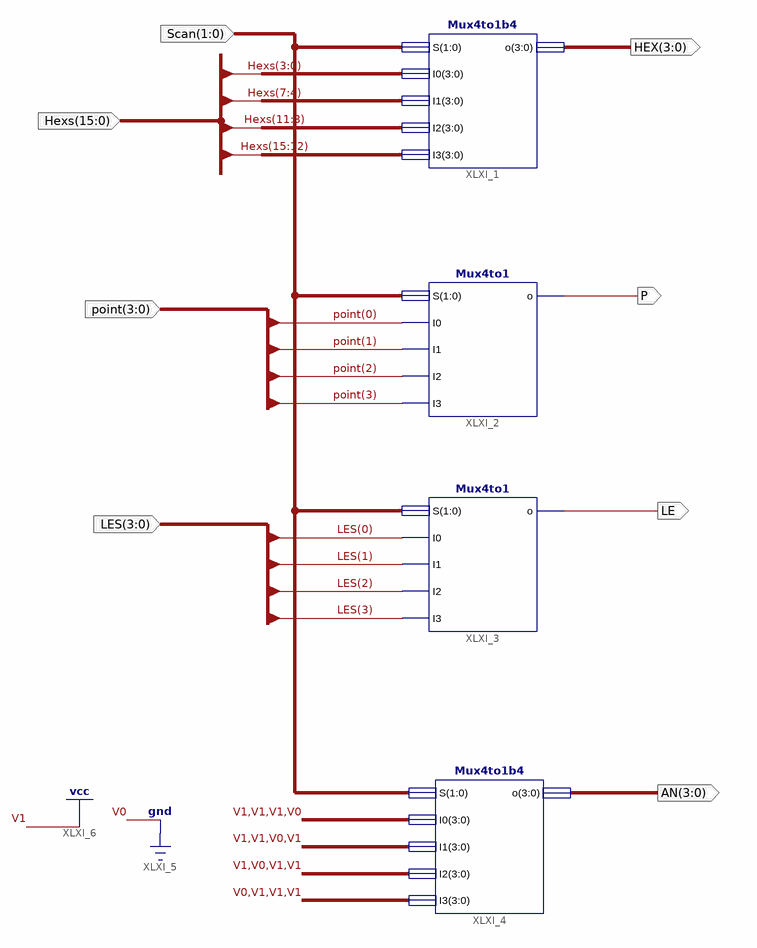
[diagram p0: schematic sheet 1]
// Xilinx ISE schematic DisplaySync.sch (kintex7) as structural Verilog: 4 symbols, 8 ports
module DisplaySync (
  input  [1:0] Scan,
  input  [15:0] Hexs,
  input  [3:0] point,
  input  [3:0] LES,
  output [3:0] HEX,
  output P,
  output LE,
  output [3:0] AN
);

  Mux4to1b4 XLXI_1 (.S(Scan), .I0(Hexs[3:0]), .I1(Hexs[7:4]), .I2(Hexs[11:8]), .I3(Hexs[15:12]), .o(HEX));
  Mux4to1 XLXI_2 (.S(Scan), .I0(point[0]), .I1(point[1]), .I2(point[2]), .I3(point[3]), .o(P));
  Mux4to1 XLXI_3 (.S(Scan), .I0(LES[0]), .I1(LES[1]), .I2(LES[2]), .I3(LES[3]), .o(LE));
  Mux4to1b4 XLXI_4 (.S(Scan), .I0(4'b1110), .I1(4'b1101), .I2(4'b1011), .I3(4'b0111), .o(AN));
endmodule
